# EAGLE design nanowii-i2c-mounting-board (EAGLE 6.4)
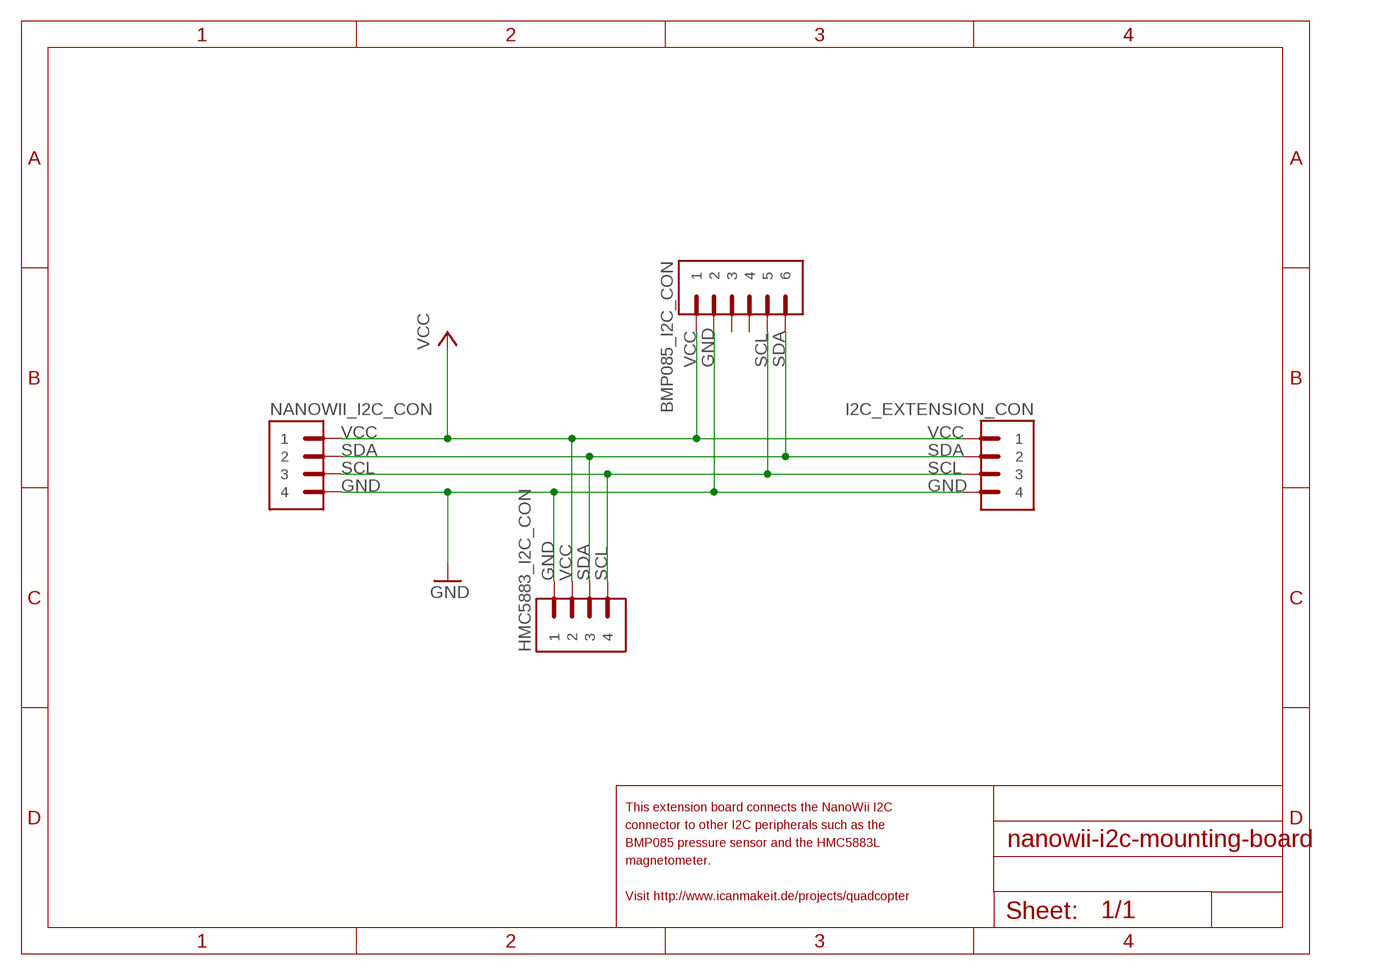
[diagram p0: schematic, sheet 1]

## Parts
BMP085_I2C_CON  PIN_HEADER_6-WIDE  [BREAKAWAY_STRAIGHT_6_WIDE]
HMC5883_I2C_CON  PIN_HEADER_4-WIDE  [BREAKAWAY_STRAIGHT_4_WIDE]
I2C_EXTENSION_CON  PIN_HEADER_4-WIDE  [BREAKAWAY_STRAIGHT_4_WIDE]
NANOWII_I2C_CON  PIN_HEADER_4-WIDE  [BREAKAWAY_STRAIGHT_4_WIDE]

## Nets
GND: BMP085_I2C_CON.2 HMC5883_I2C_CON.1 I2C_EXTENSION_CON.4 NANOWII_I2C_CON.4
SCL: BMP085_I2C_CON.5 HMC5883_I2C_CON.4 I2C_EXTENSION_CON.3 NANOWII_I2C_CON.3
SDA: BMP085_I2C_CON.6 HMC5883_I2C_CON.3 I2C_EXTENSION_CON.2 NANOWII_I2C_CON.2
VCC: BMP085_I2C_CON.1 HMC5883_I2C_CON.2 I2C_EXTENSION_CON.1 NANOWII_I2C_CON.1
Unconnected: BMP085_I2C_CON.3 BMP085_I2C_CON.4

## Notes on the sheet
- This extension board connects the NanoWii I2C
- connector to other I2C peripherals such as the
- BMP085 pressure sensor and the HMC5883L
- magnetometer.
- Visit http://www.icanmakeit.de/projects/quadcopter

## Library data of the parts
BMP085_I2C_CON = icmi-connectors:PIN_HEADER_6
HMC5883_I2C_CON I2C_EXTENSION_CON NANOWII_I2C_CON = icmi-connectors:PIN_HEADER_4

## Board
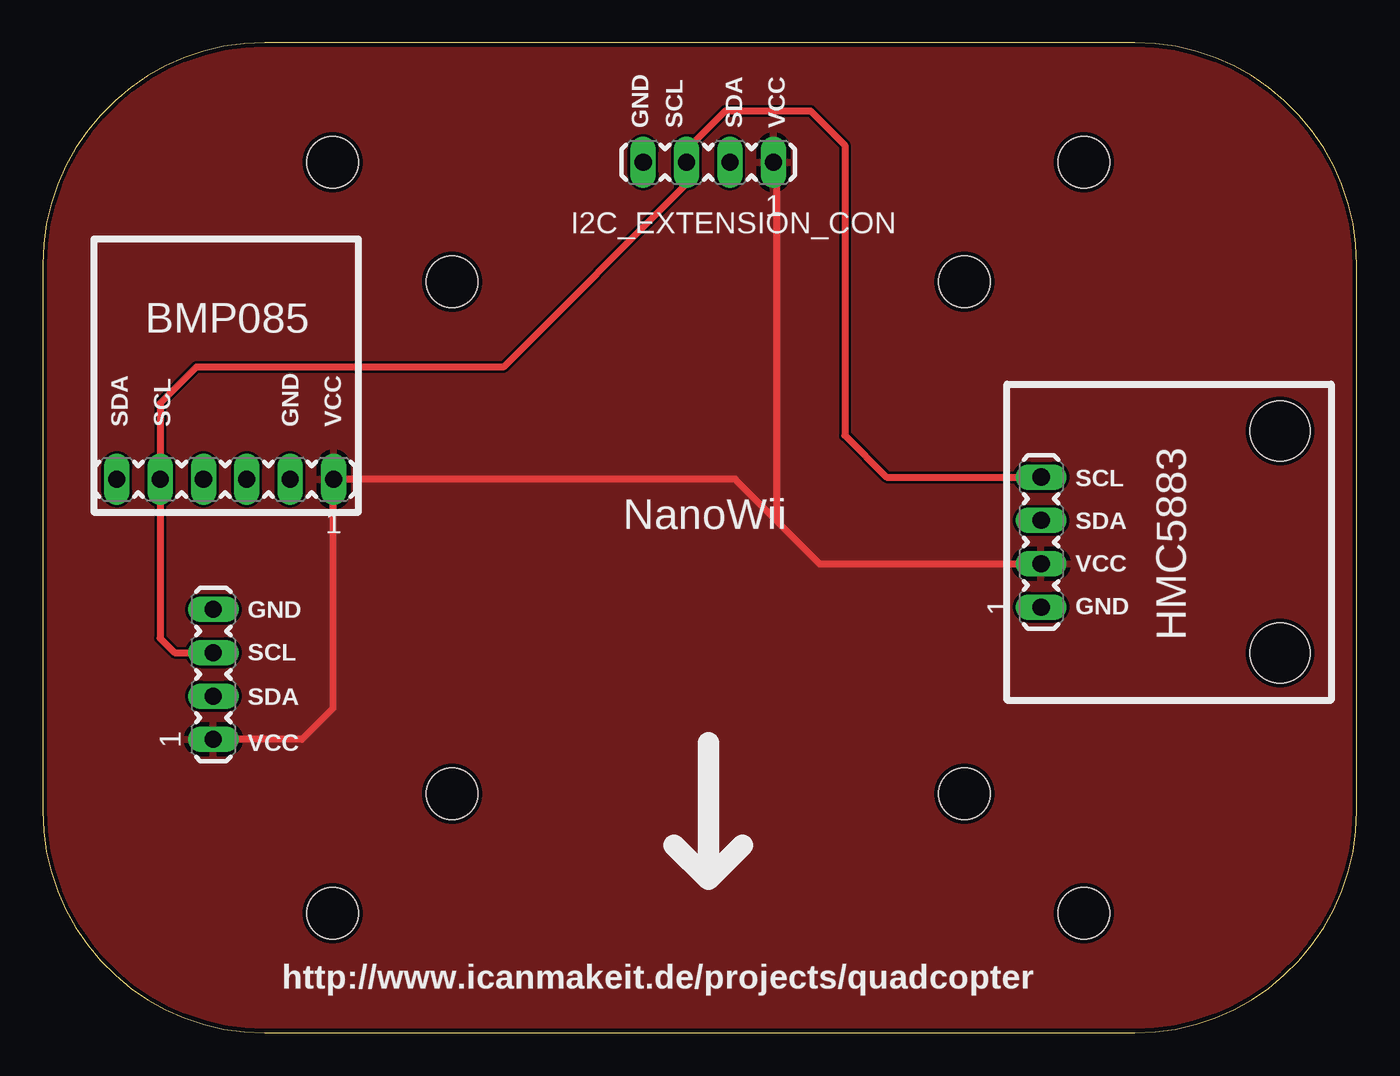
[diagram p1: board, top side]
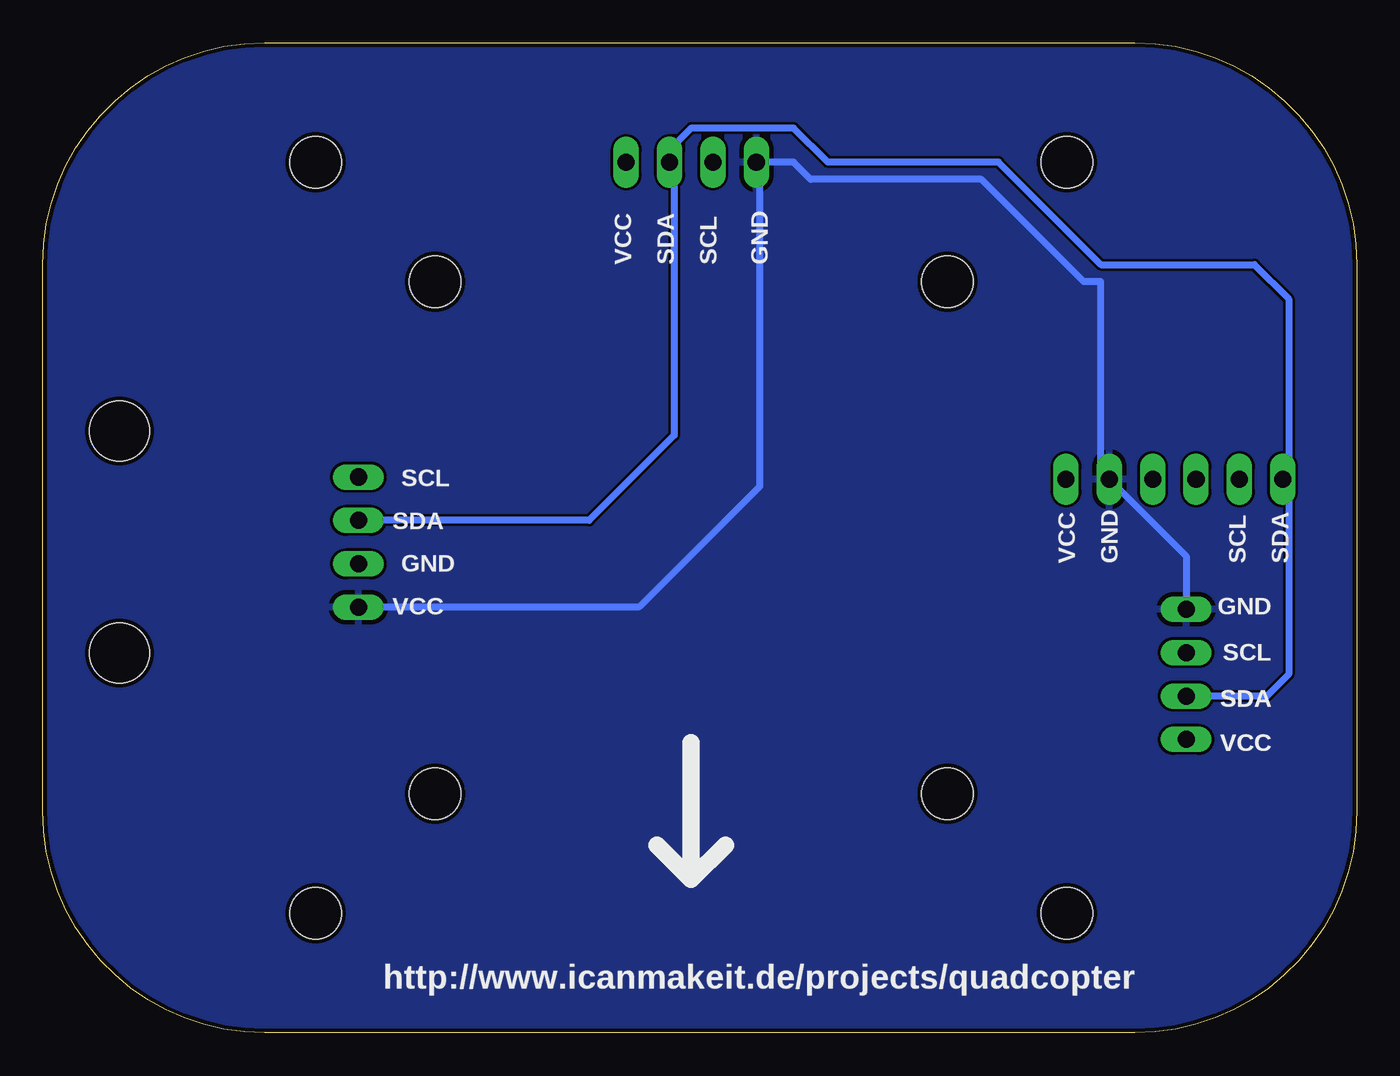
[diagram p2: board, bottom side, seen from below]

Size 77 x 58 mm. Coordinates in mm from the lower left corner, seen from the top.
Outline: 13,0 64,0 arc90 77,13 77,45 arc90 64,58 13,58 arc90 0,45 0,13 arc90 13,0
Copper layers (1*16): Top 0.035mm / dielectric 1.5mm / Bottom 0.035mm
Design rules "ElecFreaks_CAM_DRC_V1.0": minimum track width 6mil, minimum drill 12mil, track to track 6mil, track to pad 6mil, pad to pad 6mil, via to via 6mil, smd to smd 0mil, copper to edge 10mil, drill to drill 10mil, minimum pad ring 10mil, minimum via ring 6mil, stop-mask expansion 2mil, vias tented up to drill 100mil, thermal gap 10mil
Holes 3 mm at 17,7 61,7 17,51 61,51 24,14 54,14 24,44 54,44
Holes 3.5 mm at 72.5,22.25 72.5,35.25

### Footprints (pad centres in the part's own frame; a part is rotated, then mirrored left to right if it is on the bottom)
BREAKAWAY_STRAIGHT_6_WIDE = drill 1 long: 1 0,-6.35; 2 0,-3.81; 3 0,-1.27; 4 0,1.27; 5 0,3.81; 6 0,6.35
BREAKAWAY_STRAIGHT_4_WIDE = drill 1 long: 1 0,-3.81; 2 0,-1.27; 3 0,1.27; 4 0,3.81

### Placement (x,y rotation side)
BMP085_I2C_CON  10.69,32.43 90 top
HMC5883_I2C_CON  58.5,28.75 0 top
I2C_EXTENSION_CON  39,51 90 top
NANOWII_I2C_CON  10,21 0 top

### Tracks (layer width: path | path; a pad name or v marks a point on that pad's centre or on a via)
GND
  Bottom 0.406: NANOWII_I2C_CON.4 10,27.93 BMP085_I2C_CON.2 15,32.93 15,44 16,44 22,50 32,50 33,51 I2C_EXTENSION_CON.4 35,50.81 35,32 42.06,24.94 HMC5883_I2C_CON.1
  pour Bottom: 0,13 0,45 arc-90 13,58 64,58 arc-94 77,44 77,13 arc-90 64,0 14,0 13,0 arc-90
SCL
  Top 0.406: NANOWII_I2C_CON.3 7.73,22.27 6.88,23.12 BMP085_I2C_CON.5 6.88,36.88 9,39 27,39 38,50 38,50.73 | I2C_EXTENSION_CON.3 38,50.73 | 38,50.73 38,52 40,54 45,54 47,52 47,35 49.44,32.56 HMC5883_I2C_CON.4
SDA
  Bottom 0.406: NANOWII_I2C_CON.2 5.27,19.73 4,21 4,32.09 BMP085_I2C_CON.6 4,32.77 4,43 6,45 15,45 21,51 31,51 33,53 39,53 40.27,51.73 I2C_EXTENSION_CON.2 40,50.73 40,35 44.98,30.02 HMC5883_I2C_CON.3
VCC
  Top 0.406: I2C_EXTENSION_CON.1 43,50.81 43,30 | 43,30 45.52,27.48 HMC5883_I2C_CON.2 | NANOWII_I2C_CON.1 15.19,17.19 17,19 17,32.39 BMP085_I2C_CON.1 40.57,32.43 43,30
  pour Top: 0,13 0,45 arc-90 13,58 64,58 arc-94 77,44 77,13 arc-90 64,0 13,0 arc-90

### Text on the board
tNames: GND | SCL | SDA | VCC | BMP085 | SDA | SCL | GND | VCC | SCL | NanoWii | SDA | VCC | GND | GND | HMC5883 | SCL | SDA | VCC | http://www.icanmakeit.de/projects/quadcopter
bNames: GND | SCL | SDA | VCC | SCL | SDA | SDA | SCL | GND | VCC | GND | VCC | GND | SCL | SDA | SDA | VCC | VCC | http://www.icanmakeit.de/projects/quadcopter